# EAGLE schematic VLNA_1_1 (EAGLE 6.2)
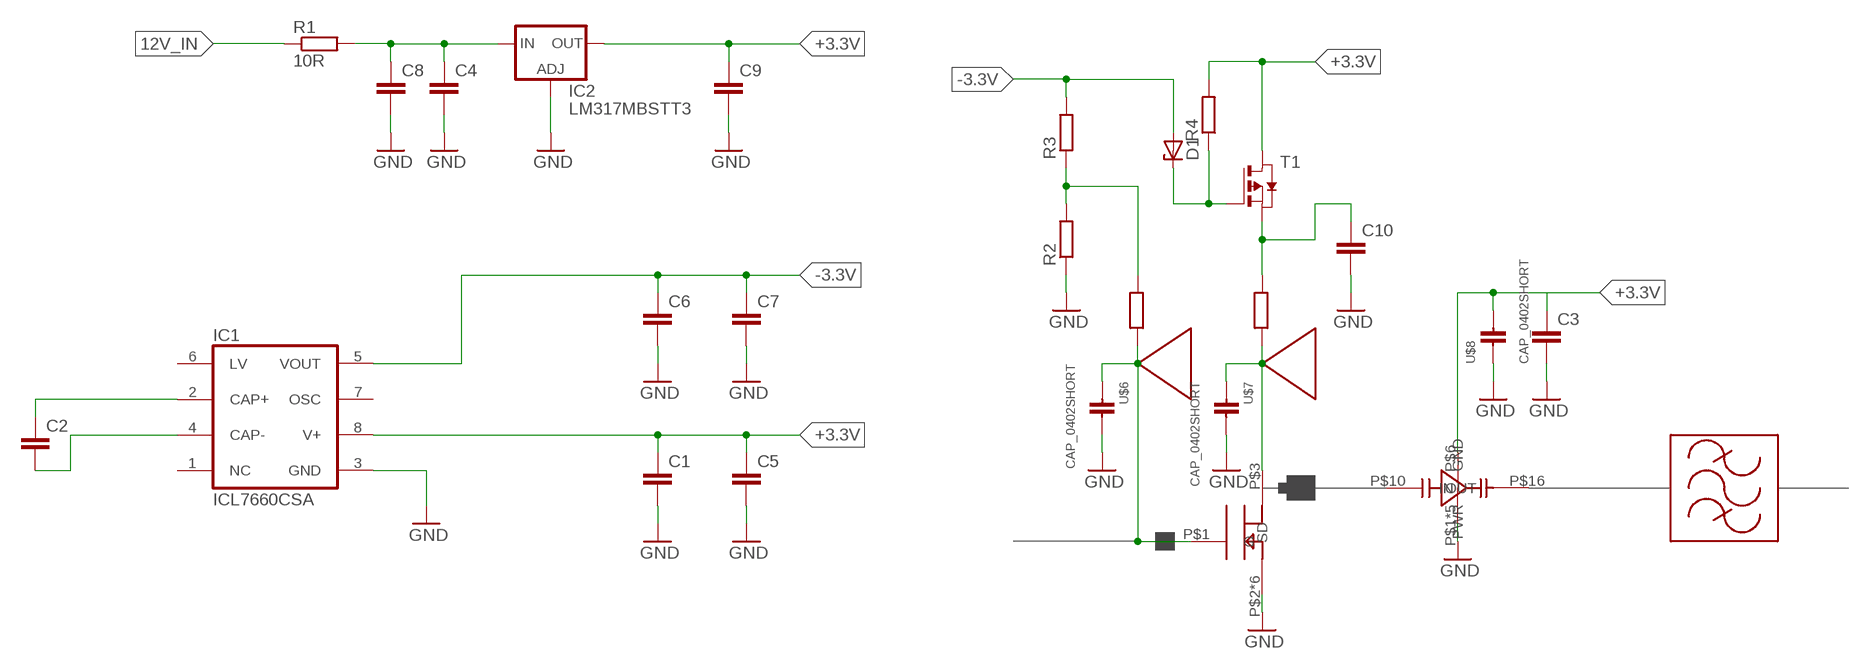
[diagram p0: schematic, sheet 1]

## Parts
C1  C-EUC0603  [C0603]
C2  C-EUC0603  [C0603]
C3  C-EUC0402  [C0402]
C4  C-EUC0603  [C0603]
C5  C-EUC0603  [C0603]
C6  C-EUC0603  [C0603]
C7  C-EUC0603  [C0603]
C8  C-EUC0805  [C0805]
C9  C-EUC0603  [C0603]
C10  C-EUC0603  [C0603]
D1  ZENER-DIODESOD80C  [SOD80C]
IC1  ICL7660CSA  [SO08]
IC2  LM317MBSTT3  [SOT223]
R1  10R  R-EU_R0805  [R0805]
R2  R-EU_R0603  [R0603]
R3  R-EU_R0603  [R0603]
R4  R-EU_R0603  [R0603]
T1  PMOSSOT23  [SOT-23]
U$2  24GHZ_OP  [FILTER]
U$3  CE3520K3  [MICROX]
U$4  HMC341  [HMC]
U$5  RES_0402SHORT  [0402S]
U$6  CAP_0402SHORT  [0402S]
U$7  CAP_0402SHORT  [0402S]
U$8  CAP_0402SHORT  [0402S]
U$9  RES_0402SHORT  [0402S]
U$10  STUB  [QTR_STUB]
U$11  STUB  [QTR_STUB]

## Nets
12V_IN: R1.1
+3.3V: C1.1 C3.1 C5.1 C9.1 IC1.8(V+) IC2.4(OUT) R4.2 T1.1(D) U$4.P$6(PWR) U$8.P$2
-3.3V: C6.1 C7.1 D1.A IC1.5(VOUT) R3.2
GND: C1.2 C3.2 C4.2 C5.2 C6.2 C7.2 C8.2 C9.2 C10.2 IC1.3(GND) IC2.1(ADJ) R2.1 U$3.P$2(S) U$3.P$4(S) U$3.P$5(S) U$3.P$6(S) U$3.P$7(S) U$3.P$8(S) U$4.P$1(GND) U$4.P$9(GND) U$4.P$11(GND) U$4.P$15(GND) U$4.P$17(GND) U$6.P$2 U$7.P$2 U$8.P$1
N$1: C2.1 IC1.2(CAP+)
N$2: C2.2 IC1.4(CAP-)
N$3: C4.1 C8.1 IC2.3(IN) R1.2
N$4: R2.2 R3.1 U$5.P$2
N$5: U$3.P$1(G) U$5.P$1 U$6.P$1
N$6: U$3.P$3(D) U$7.P$1 U$9.P$1
N$9: C10.1 T1.2(S) U$9.P$2
N$10: D1.C R4.1 T1.3(G)
Unconnected: IC1.1(NC) IC1.6(LV) IC1.7(OSC) U$4.P$10(IN) U$4.P$16(OUT)

## Library data of the parts
C1-C10 = rcl:C-EU: CAPACITOR, European symbol
D1 = diode:ZENER-DIODE: Z-Diode
IC1 = maxim:ICL7660CSA: VOLTAGE CONVERTER; MF: MAXIM; MPN: ICL7660CSA; OC_FARNELL: 9724710; OC_NEWARK: 34C3732
IC2 = v-reg:LM317?*: 500 mA Adjustable Output Positive Voltage Regulator Source: http://www.onsemi.co.jp .. LM317M-D.PDF
R1-R4 = rcl:R-EU_: RESISTOR, European symbol
T1 = zetex:PMOSSOT23: MOS FET; OC_FARNELL: unknown; OC_NEWARK: unknown
U$2 = 24GHz:24GHZ_OP
U$3 = 24GHz:CE3520K3
U$4 = 24GHz:HMC341
U$5 U$9 = 24GHz:RES_0402
U$6-U$8 = 24GHz:CAP_0402
U$10 U$11 = 24GHz:STUB

## Net classes
2 SPACED: clearance 0.8 mm